# Altium schematic sheet S1_Cover_Page.SchDoc: Cover Page
size Tabloid; DrawnBy: Dhrumil Parikh; SheetNumber: 1; SheetTotal: 6; PageSetup: Record=PageOptions|CenterHorizontal=True|CenterVertical=True|PrintScale=0.62|XCorrection=1.00|YCorrection=1.00|PrintKind=1|BorderSize=5000000|LeftOffset=0|BottomOffset=0|Orientation=2|PaperLength=1000|PaperWidth=1000|Scale=100|PaperSource=7|PrintQuality=600|MediaType=1|DitherType=10|PaperKind=Letter|PrintScaleMode=1; PageSize: T
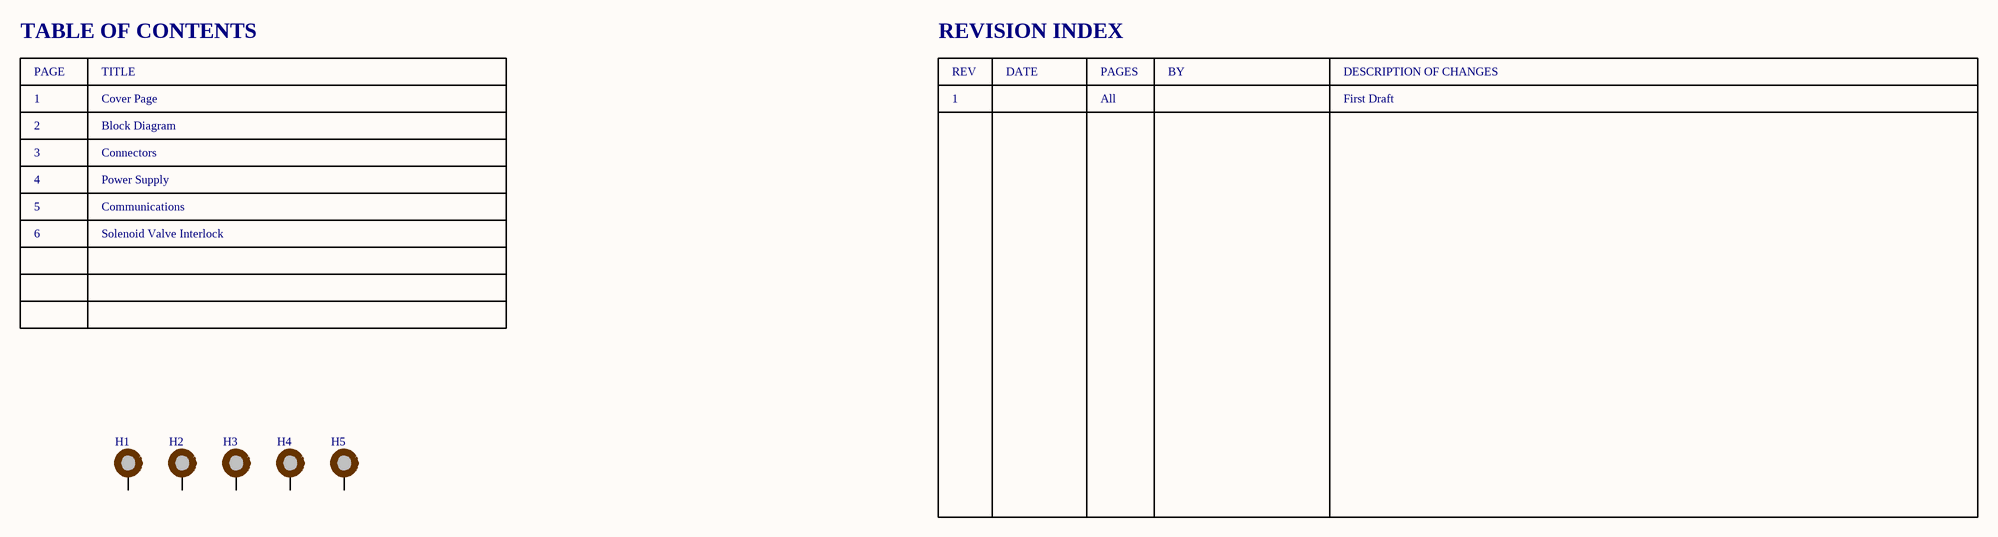
[diagram p0: S1_Cover_Page.SchDoc]

## Parts
H1  MTG_HOLE PTH, 3.0mm  [MH_PTH_H3.0mmXP6.0mm]  (value not drawn)  (no BOM)
H2  MTG_HOLE PTH, 3.0mm  [MH_PTH_H3.0mmXP6.0mm]  (value not drawn)  (no BOM)
H3  MTG_HOLE PTH, 3.0mm  [MH_PTH_H3.0mmXP6.0mm]  (value not drawn)  (no BOM)
H4  MTG_HOLE PTH, 3.0mm  [MH_PTH_H3.0mmXP6.0mm]  (value not drawn)  (no BOM)
H5  MTG_HOLE PTH, 3.0mm  [MH_PTH_H3.0mmXP6.0mm]  (value not drawn)  (no BOM)

## Nets

Not connected (* = marked no-connect by the designer): H1 1; H2 1; H3 1; H4 1; H5 1

## Notes on the sheet
- TABLE OF CONTENTS
- PAGE
- 1
- TITLE
- Cover Page
- REVISION INDEX
- REV
- DATE
- PAGES
- All
- BY
- DESCRIPTION OF CHANGES
- First Draft
- 2
- 3
- Block Diagram
- Connectors
- 4
- 5
- 6
- Power Supply
- Communications
- Solenoid Valve Interlock
- Title:
- Project:
- Size:
- Date:
- DrawnBy:
- Rev:
- Project Lead:
- Sheet
- Dhrumil Parikh
- of
- 200 University Ave W
- Waterloo, ON
- N2L 3G1, Canada
- File:

## Library data of the parts
H1-H5 = MTG_HOLE PTH, 3.0mm: PTH, 3.0mm; VALUE: PTH_3.0MM